# Altium schematic sheet PSU2.SchDoc: =Board +' X7A15T-PSU-LTTM4644'
size A3; Date: OCT 2018; CheckedBy: ALL; Author: Moerz; CompanyName: TDK-Micronas GmbH; DrawnBy: Moerz; Engineer: Moerz; Address1: Hans-Bunte-Strasse 19; Address2: D-79108 Freiburg; Address3: Germany; SheetNumber: 54; SheetTotal: 80; DateDraw: OCT 2018; DateChecked: N/A; PageSetup: Record=PageOptions|CenterHorizontal=True|CenterVertical=True|PrintScale=0.97|XCorrection=1.00|YCorrection=1.00|PrintKind=0|BorderSize=5000000|LeftOffset=0|BottomOffset=0|Orientation=2|PaperLength=1000|PaperWidth=1000|Scale=100|PaperSource=7|PrintQuality=-3|MediaType=1|DitherType=10|PrintScaleMode=1|PaperKind=A4|PaperIndex=9; TitleTyp: Title-Typ; Block: CPU & SCT8; Workspace: Workspace
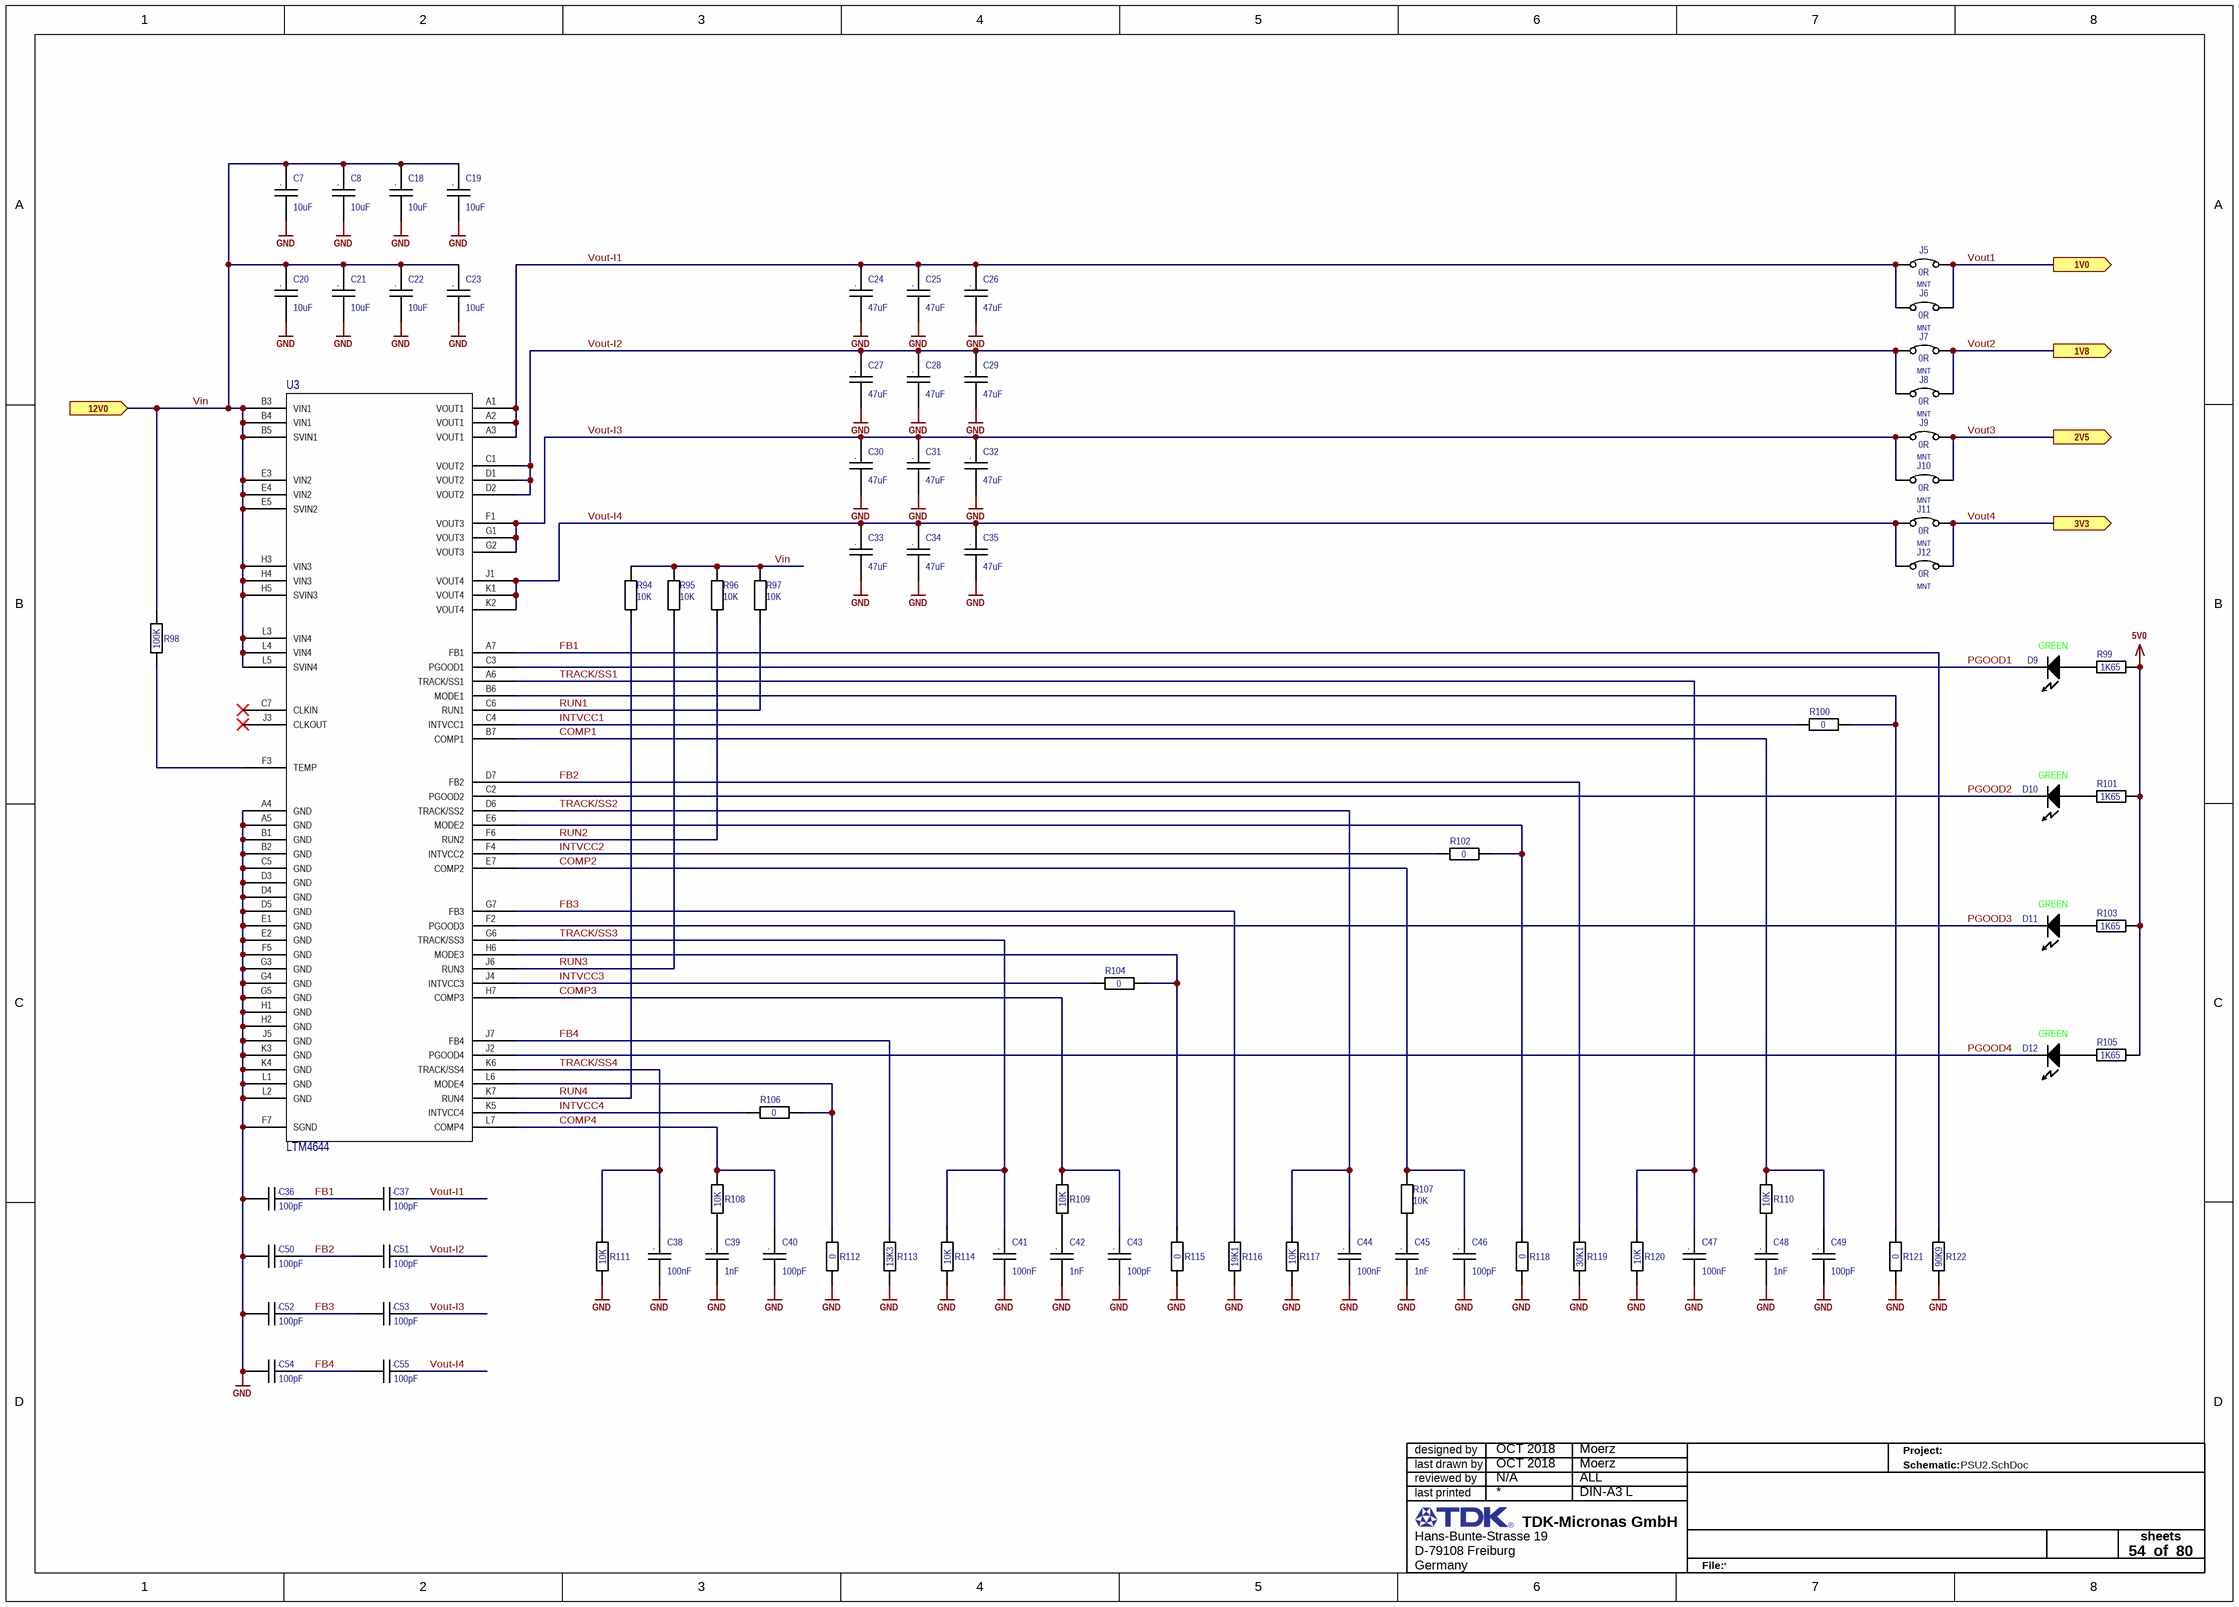
[diagram p0: PSU2.SchDoc]

## Parts
C7  value 10uF  [C1206 Reflow]  (hidden comment: C)
C8  value 10uF  [C1206 Reflow]  (hidden comment: C)
C18  value 10uF  [C1206 Reflow]  (hidden comment: C)
C19  value 10uF  [C1206 Reflow]  (hidden comment: C)
C20  value 10uF  [C1206 Reflow]  (hidden comment: C)
C21  value 10uF  [C1206 Reflow]  (hidden comment: C)
C22  value 10uF  [C1206 Reflow]  (hidden comment: C)
C23  value 10uF  [C1206 Reflow]  (hidden comment: C)
C24  value 47uF  [C1210 Reflow]  (hidden comment: C)
C25  value 47uF  [C1210 Reflow]  (hidden comment: C)
C26  value 47uF  [C1210 Reflow]  (hidden comment: C)
C27  value 47uF  [C1210 Reflow]  (hidden comment: C)
C28  value 47uF  [C1210 Reflow]  (hidden comment: C)
C29  value 47uF  [C1210 Reflow]  (hidden comment: C)
C30  value 47uF  [C1210 Reflow]  (hidden comment: C)
C31  value 47uF  [C1210 Reflow]  (hidden comment: C)
C32  value 47uF  [C1210 Reflow]  (hidden comment: C)
C33  value 47uF  [C1210 Reflow]  (hidden comment: C)
C34  value 47uF  [C1210 Reflow]  (hidden comment: C)
C35  value 47uF  [C1210 Reflow]  (hidden comment: C)
C36  value 100pF  [C0402 Reflow]  (hidden comment: C)
C37  value 100pF  [C0402 Reflow]  (hidden comment: C)
C38  value 100nF  [C0402 Reflow]  (hidden comment: C)
C39  value 1nF  [C0402 Reflow]  (hidden comment: C)
C40  value 100pF  [C0402 Reflow]  (hidden comment: C)
C41  value 100nF  [C0402 Reflow]  (hidden comment: C)
C42  value 1nF  [C0402 Reflow]  (hidden comment: C)
C43  value 100pF  [C0402 Reflow]  (hidden comment: C)
C44  value 100nF  [C0402 Reflow]  (hidden comment: C)
C45  value 1nF  [C0402 Reflow]  (hidden comment: C)
C46  value 100pF  [C0402 Reflow]  (hidden comment: C)
C47  value 100nF  [C0402 Reflow]  (hidden comment: C)
C48  value 1nF  [C0402 Reflow]  (hidden comment: C)
C49  value 100pF  [C0402 Reflow]  (hidden comment: C)
C50  value 100pF  [C0402 Reflow]  (hidden comment: C)
C51  value 100pF  [C0402 Reflow]  (hidden comment: C)
C52  value 100pF  [C0402 Reflow]  (hidden comment: C)
C53  value 100pF  [C0402 Reflow]  (hidden comment: C)
C54  value 100pF  [C0402 Reflow]  (hidden comment: C)
C55  value 100pF  [C0402 Reflow]  (hidden comment: C)
D9  Color: GREEN  [L0603G]  (hidden comment: D)
D10  Color: GREEN  [L0603G]  (hidden comment: D)
D11  Color: GREEN  [L0603G]  (hidden comment: D)
D12  Color: GREEN  [L0603G]  (hidden comment: D)
J5  value 0R  POPULATED: MNT  [JumperSMD]  (hidden comment: J)
J6  value 0R  POPULATED: MNT  [JumperSMD]  (hidden comment: J)
J7  value 0R  POPULATED: MNT  [JumperSMD]  (hidden comment: J)
J8  value 0R  POPULATED: MNT  [JumperSMD]  (hidden comment: J)
J9  value 0R  POPULATED: MNT  [JumperSMD]  (hidden comment: J)
J10  value 0R  POPULATED: MNT  [JumperSMD]  (hidden comment: J)
J11  value 0R  POPULATED: MNT  [JumperSMD]  (hidden comment: J)
J12  value 0R  POPULATED: MNT  [JumperSMD]  (hidden comment: J)
R94  value 10K  [R0402 Reflow]  (hidden comment: R)
R95  value 10K  [R0402 Reflow]  (hidden comment: R)
R96  value 10K  [R0402 Reflow]  (hidden comment: R)
R97  value 10K  [R0402 Reflow]  (hidden comment: R)
R98  value 100K  [R0402 Reflow]  (hidden comment: R)
R99  value 1K65  [R0402 Reflow]  (hidden comment: R)
R100  value 0  [R0402 Reflow]  (hidden comment: R)
R101  value 1K65  [R0402 Reflow]  (hidden comment: R)
R102  value 0  [R0402 Reflow]  (hidden comment: R)
R103  value 1K65  [R0402 Reflow]  (hidden comment: R)
R104  value 0  [R0402 Reflow]  (hidden comment: R)
R105  value 1K65  [R0402 Reflow]  (hidden comment: R)
R106  value 0  [R0402 Reflow]  (hidden comment: R)
R107  value 10K  [R0402 Reflow]  (hidden comment: R)
R108  value 10K  [R0402 Reflow]  (hidden comment: R)
R109  value 10K  [R0402 Reflow]  (hidden comment: R)
R110  value 10K  [R0402 Reflow]  (hidden comment: R)
R111  value 10K  [R0402 Reflow]  (hidden comment: R)
R112  value 0  [R0402 Reflow]  (hidden comment: R)
R113  value 13K3  [R0402 Reflow]  (hidden comment: R)
R114  value 10K  [R0402 Reflow]  (hidden comment: R)
R115  value 0  [R0402 Reflow]  (hidden comment: R)
R116  value 19K1  [R0402 Reflow]  (hidden comment: R)
R117  value 10K  [R0402 Reflow]  (hidden comment: R)
R118  value 0  [R0402 Reflow]  (hidden comment: R)
R119  value 30K1  [R0402 Reflow]  (hidden comment: R)
R120  value 10K  [R0402 Reflow]  (hidden comment: R)
R121  value 0  [R0402 Reflow]  (hidden comment: R)
R122  value 90K9  [R0402 Reflow]  (hidden comment: R)
U3  U  [LTM4644]  (value not drawn)

## Ports
1V0 (out), 1V8 (out), 2V5 (out), 3V3 (out), 12V0 (in)

## Nets
5V0: R99.2 R101.2 R103.2 R105.2
GND: C7.2 C8.2 C18.2 C19.2 C20.2 C21.2 C22.2 C23.2 C24.2 C25.2 C26.2 C27.2 C28.2 C29.2 C30.2 C31.2 C32.2 C33.2 C34.2 C35.2 C36.2 C38.2 C39.2 C40.2 C41.2 C42.2 C43.2 C44.2 C45.2 C46.2 C47.2 C48.2 C49.2 C50.2 C52.2 C54.2 R111.1 R112.1 R113.1 R114.1 R115.1 R116.1 R117.1 R118.1 R119.1 R120.1 R121.1 R122.1 U3.A4(GND) U3.A5(GND) U3.B1(GND) U3.B2(GND) U3.C5(GND) U3.D3(GND) U3.D4(GND) U3.D5(GND) U3.E1(GND) U3.E2(GND) U3.F5(GND) U3.F7(SGND) U3.G3(GND) U3.G4(GND) U3.G5(GND) U3.H1(GND) U3.H2(GND) U3.J5(GND) U3.K3(GND) U3.K4(GND) U3.L1(GND) U3.L2(GND)
COMP1: C49.1 R110.2 U3.B7(COMP1)
COMP2: C46.1 R107.2 U3.E7(COMP2)
COMP3: C43.1 R109.2 U3.H7(COMP3)
COMP4: C40.1 R108.2 U3.L7(COMP4)
FB1: C36.1 C37.2 R122.2 U3.A7(FB1)
FB2: C50.1 C51.2 R119.2 U3.D7(FB2)
FB3: C52.1 C53.2 R116.2 U3.G7(FB3)
FB4: C54.1 C55.2 R113.2 U3.J7(FB4)
INTVCC1: R100.2 U3.C4(INTVCC1)
INTVCC2: R102.2 U3.F4(INTVCC2)
INTVCC3: R104.2 U3.J4(INTVCC3)
INTVCC4: R106.2 U3.K5(INTVCC4)
PGOOD1: D9.2(Cathode) U3.C3(PGOOD1)
PGOOD2: D10.2(Cathode) U3.C2(PGOOD2)
PGOOD3: D11.2(Cathode) U3.F2(PGOOD3)
PGOOD4: D12.2(Cathode) U3.J2(PGOOD4)
RUN1: R97.1 U3.C6(RUN1)
RUN2: R96.1 U3.F6(RUN2)
RUN3: R95.1 U3.J6(RUN3)
RUN4: R94.1 U3.K7(RUN4)
TRACK/SS1: C47.1 R120.2 U3.A6(TRACK/SS1)
TRACK/SS2: C44.1 R117.2 U3.D6(TRACK/SS2)
TRACK/SS3: C41.1 R114.2 U3.G6(TRACK/SS3)
TRACK/SS4: C38.1 R111.2 U3.K6(TRACK/SS4)
Vin: C7.1 C8.1 C18.1 C19.1 C20.1 C21.1 C22.1 C23.1 R94.2 R95.2 R96.2 R97.2 R98.2 U3.B3(VIN1) U3.B4(VIN1) U3.B5(SVIN1) U3.E3(VIN2) U3.E4(VIN2) U3.E5(SVIN2) U3.H3(VIN3) U3.H4(VIN3) U3.H5(SVIN3) U3.L3(VIN4) U3.L4(VIN4) U3.L5(SVIN4) ; port 12V0
Vout1: J5.2 J6.2 ; port 1V0
Vout2: J7.2 J8.2 ; port 1V8
Vout3: J9.2 J10.2 ; port 2V5
Vout4: J11.2 J12.2 ; port 3V3
Vout-I1: C24.1 C25.1 C26.1 C37.1 J5.1 J6.1 U3.A1(VOUT1) U3.A2(VOUT1) U3.A3(VOUT1)
Vout-I2: C27.1 C28.1 C29.1 C51.1 J7.1 J8.1 U3.C1(VOUT2) U3.D1(VOUT2) U3.D2(VOUT2)
Vout-I3: C30.1 C31.1 C32.1 C53.1 J9.1 J10.1 U3.F1(VOUT3) U3.G1(VOUT3) U3.G2(VOUT3)
Vout-I4: C33.1 C34.1 C35.1 C55.1 J11.1 J12.1 U3.J1(VOUT4) U3.K1(VOUT4) U3.K2(VOUT4)
NetC39_1: C39.1 R108.1
NetC42_1: C42.1 R109.1
NetC45_1: C45.1 R107.1
NetC48_1: C48.1 R110.1
NetD9_1: D9.1(Anode) R99.1
NetD10_1: D10.1(Anode) R101.1
NetD11_1: D11.1(Anode) R103.1
NetD12_1: D12.1(Anode) R105.1
NetR98_1: R98.1 U3.F3(TEMP)
NetR100_1: R100.1 R121.2 U3.B6(MODE1)
NetR102_1: R102.1 R118.2 U3.E6(MODE2)
NetR104_1: R104.1 R115.2 U3.H6(MODE3)
NetR106_1: R106.1 R112.2 U3.L6(MODE4)

Not connected (* = marked no-connect by the designer): U3 C7(CLKIN)* J3(CLKOUT)*

## Notes on the sheet
- designed by
- reviewed by
- last drawn by
- Project:
- Schematic:
- last printed
- DIN-A3 L
- sheets
- of
- File:
- (in symbol C) .

## Library data of the parts
C7 C8 C18-C23 = C: CAP CER 10UF 25V X7R 1206; 04. Manufacturer: TDK Corporation; 07. Manufacturer  Part Number: C3216X7R1E106K160AB; Tolerance: ±10%; 03. Unit Price: 0.66; 13. Created Date/Name: AUG2018/Hören; Voltage Rating: 25V; Type: X7R; ComponentLink1Description: Info; ComponentLink1URL: https://www.digikey.de/products/en?keywords=445-7705-6-ND; 02. Distributor Part Number: 445-7705-6-ND; 09. Operating Temperature: -55°C ~ 125°C; 11. RoHS: YES; 01. Distributor: DigiKey; ComponentLink2Description: DataSheet; Package: 1206
C24-C35 = C: CAP CER 47UF 10V X5R 1210; 04. Manufacturer: Samsung Electro-Mechanics; 07. Manufacturer  Part Number: CL32A476MPJNNNE; Tolerance: ±20%; 03. Unit Price: 0.88; 13. Created Date/Name: AUG2018/Hören; Voltage Rating: 10V; Type: X5R; ComponentLink1Description: Info; ComponentLink1URL: *; 02. Distributor Part Number: 1276-3380-6-ND; 09. Operating Temperature: -55°C ~ 85°C; 11. RoHS: YES; 01. Distributor: DigiKey; ComponentLink2Description: DataSheet; Package: 1210
C36 C37 C40 C43 C46 C49-C55 = C: CAP CER 100PF 25V C0G/NP0 0402; 04. Manufacturer: KEMET; 07. Manufacturer  Part Number: C0402C101J3GACTU; Tolerance: ±5%; Type: C0G, NP0; 03. Unit Price: 0.09; 13. Created Date/Name: AUG2018/Hören; Voltage Rating: 25V; ComponentLink1Description: Info; ComponentLink1URL: https://www.digikey.de/products/en?keywords=399-1022-6-ND; 02. Distributor Part Number: 399-1022-6-ND; 09. Operating Temperature: -55°C ~ 125°C; 11. RoHS: YES; 01. Distributor: DigiKey; ComponentLink2Description: DataSheet; Package: 0402
C38 C41 C44 C47 = C: CAP CER 0.1UF 25V X7R 0402; 04. Manufacturer: Yageo; 07. Manufacturer  Part Number: CC0402KRX7R8BB104; Tolerance: ±10%; 03. Unit Price: 0.09; 13. Created Date/Name: AUG2018/Hören; Voltage Rating: 25V; Type: X7R; ComponentLink1Description: Info; ComponentLink1URL: https://www.digikey.de/products/en?keywords=311-2077-6-ND; 02. Distributor Part Number: 311-2077-6-ND; 09. Operating Temperature: -55°C ~ 125°C; 11. RoHS: YES; 01. Distributor: DigiKey; ComponentLink2Description: DataSheet; Package: 0402
C39 C42 C45 C48 = C: CAP CER 1000PF 25V X7R 0402; 04. Manufacturer: KEMET; 07. Manufacturer  Part Number: C0402C102K3RACTU; Tolerance: ±10%; 03. Unit Price: 0.09; 13. Created Date/Name: AUG2018/Hören; Voltage Rating: 25V; Type: X7R; ComponentLink1Description: Info; ComponentLink1URL: https://www.digikey.de/products/en?keywords=399-1031-6-ND; 02. Distributor Part Number: 399-1031-6-ND; 09. Operating Temperature: -55°C ~ 125°C; 11. RoHS: YES; 01. Distributor: DigiKey; ComponentLink2Description: DataSheet; Package: 0402
D9-D12 = LED: LED GREEN DIFFUSED 0603 SMD; 04. Manufacturer: OSRAM Opto Semiconductors Inc.; 07. Manufacturer  Part Number: LG L29K-G2J1-24-Z; Vf: 1.7V; If: 2mA; Wave Length: 570nm; Viewing Angle: 160°; 03. Unit Price: 0.4; 13. Created Date/Name: AUG2018/Hören; ComponentLink1Description: Info; ComponentLink1URL: https://www.digikey.de/products/en?keywords=475-2709-6-ND; ComponentLink2Description: DataSheet; ComponentLink2URL: https://www.digikey.de/products/en?keywords=475-2709-6-ND; 02. Distributor Part Number: 475-2709-6-ND; 11. RoHS: YES; 01. Distributor: DigiKey
J5-J12 = Jumper SMD: RES SMD 0 OHM JUMPER 1/10W 0603; 04. Manufacturer: Yageo; 07. Manufacturer  Part Number: RC0603JR-070RL; 03. Unit Price: 0.09; 01. Distributor: DigiKey; 02. Distributor Part Number: 311-0.0GRDKR-ND; 09. Operating Temperature: -55°C ~ 155°C; 11. RoHS: YES; Package: 0603; ComponentLink4Description: Info; ComponentLink4URL: https://www.digikey.de/product-detail/en/yageo/RC0603JR-070RL/311-0.0GRDKR-ND/732569; ComponentLink5Description: DataSheet; ComponentLink5URL: http://www.yageo.com/documents/recent/PYu-RC_Group_51_RoHS_L_10.pdf
R94-R97 R107-R111 R114 R117 R120 = R: RES SMD 10K OHM 1% 1/16W 0402; 04. Manufacturer: Yageo; 07. Manufacturer  Part Number: RC0402FR-0710KL; 03. Unit Price: 0.09; 13. Created Date/Name: AUG2018/Hören; Power Rating: 63mW; Tolerance: ±1%; ComponentLink1URL: https://www.digikey.de/products/en?keywords=311-10.0KLRDKR-ND; ComponentLink1Description: Info; 02. Distributor Part Number: 311-10.0KLRDKR-ND; 09. Operating Temperature: -55°C ~ 155°C; 11. RoHS: YES; 01. Distributor: DigiKey; ComponentLink2Description: DataSheet; Type: Thick Film; Package: 0402
R98 = R: RES SMD 100K OHM 1% 1/16W 0402; 04. Manufacturer: Yageo; 07. Manufacturer  Part Number: RC0402FR-07100KL; 03. Unit Price: 0.09; 13. Created Date/Name: AUG2018/Hören; Power Rating: 63mW; Tolerance: ±1%; ComponentLink1URL: *; ComponentLink1Description: Info; 02. Distributor Part Number: 311-100KLRDKR-ND; 09. Operating Temperature: -55°C ~ 155°C; 11. RoHS: YES; 01. Distributor: DigiKey; ComponentLink2Description: DataSheet; Type: Thick Film; Package: 0402
R99 R101 R103 R105 = R: RES SMD 1.65K OHM 1% 1/16W 0402; 04. Manufacturer: Yageo; 07. Manufacturer  Part Number: RC0402FR-071K65L; 03. Unit Price: 0.09; 13. Created Date/Name: AUG2018/Hören; Power Rating: 63mW; Tolerance: ±1%; ComponentLink1URL: https://www.digikey.de/product-detail/en/yageo/RC0402FR-071K65L/YAG3043DKR-ND/5282914; ComponentLink1Description: Info; 02. Distributor Part Number: YAG3043DKR-ND; 09. Operating Temperature: -55°C ~ 155°C; 11. RoHS: YES; 01. Distributor: DigiKey; ComponentLink2Description: DataSheet; Type: Thick Film; Package: 0402
R100 R102 R104 R106 R112 R115 R118 R121 = R: RES SMD 0 OHM JUMPER 1/16W 0402; 04. Manufacturer: Yageo; 07. Manufacturer  Part Number: RC0402JR-070RL; 03. Unit Price: 0.09; 13. Created Date/Name: AUG2018/Hören; Power Rating: 63mW; ComponentLink1URL: https://www.digikey.de/products/en?keywords=311-0.0JRDKR-ND; ComponentLink1Description: Info; 02. Distributor Part Number: 311-0.0JRDKR-ND; 09. Operating Temperature: -55°C ~ 155°C; 11. RoHS: YES; 01. Distributor: DigiKey; ComponentLink2Description: DataSheet; Type: Thick Film; Package: 0402
R113 = R: RES SMD 13.3K OHM 1% 1/16W 0402; 04. Manufacturer: Yageo; 07. Manufacturer  Part Number: RC0402FR-0713K3L; 03. Unit Price: 0.09; 13. Created Date/Name: AUG2018/Hören; Power Rating: 63mW; Tolerance: ±1%; ComponentLink1URL: https://www.digikey.de/products/en?keywords=YAG2974DKR-ND; ComponentLink1Description: Info; 02. Distributor Part Number: YAG2974DKR-ND; 09. Operating Temperature: -55°C ~ 155°C; 11. RoHS: YES; 01. Distributor: DigiKey; ComponentLink2Description: DataSheet; Type: Thick Film; Package: 0402
R116 = R: RES SMD 19.1K OHM 1% 1/16W 0402; 04. Manufacturer: Yageo; 07. Manufacturer  Part Number: RC0402FR-0719K1L; 03. Unit Price: 0.09; 13. Created Date/Name: AUG2018/Hören; Power Rating: 63mW; Tolerance: ±1%; ComponentLink1URL: *; ComponentLink1Description: Info; 02. Distributor Part Number: 311-19.1KLRDKR-ND; 09. Operating Temperature: -55°C ~ 155°C; 11. RoHS: YES; 01. Distributor: DigiKey; ComponentLink2Description: DataSheet; Type: Thick Film; Package: 0402
R119 = R: RES SMD 30.1K OHM 1% 1/16W 0402; 04. Manufacturer: Yageo; 07. Manufacturer  Part Number: RC0402FR-0730K1L; 03. Unit Price: 0.09; 13. Created Date/Name: AUG2018/Hören; Power Rating: 63mW; Tolerance: ±1%; ComponentLink1URL: https://www.digikey.de/products/en?keywords=311-30.1KLRDKR-ND; ComponentLink1Description: Info; 02. Distributor Part Number: 311-30.1KLRDKR-ND; 09. Operating Temperature: -55°C ~ 155°C; 11. RoHS: YES; 01. Distributor: DigiKey; ComponentLink2Description: DataSheet; Type: Thick Film; Package: 0402
R122 = R: RES SMD 90.9K OHM 1% 1/16W 0402; 04. Manufacturer: Yageo; 07. Manufacturer  Part Number: RC0402FR-0790K9L; 03. Unit Price: 0.09; 13. Created Date/Name: AUG2018/Hören; Power Rating: 63mW; Tolerance: ±1%; ComponentLink1URL: *; ComponentLink1Description: Info; 02. Distributor Part Number: 311-90.9KLRDKR-ND; 09. Operating Temperature: -55°C ~ 155°C; 11. RoHS: YES; 01. Distributor: DigiKey; ComponentLink2Description: DataSheet; Type: Thick Film; Package: 0402
U3 = LTM4644: DC DC CONVERTER 4X0.6-5.5V; MFR-PN: LTM4644EY#PBF; MFR: LINEAR TECHNOLOGY; 04. Manufacturer: Linear Technology/Analog Devices; POPULATED: yes; 03. Unit Price: 39.30; 01. Distributor: DigiKey; 02. Distributor Part Number: LTM4644EY#PBF-ND; 07. Manufacturer  Part Number: LTM4644EY#PBF; 09. Operating Temperature: -40°C ~ 125°C; 11. RoHS: YES; ComponentLink4Description: Info; ComponentLink4URL: https://www.digikey.de/products/en?keywords=LTM4644EY%23PBF; ComponentLink5Description: DataSheet; ComponentLink5URL: http://www.analog.com/media/en/technical-documentation/data-sheets/4644fe.pdf; NicName: LTM4644